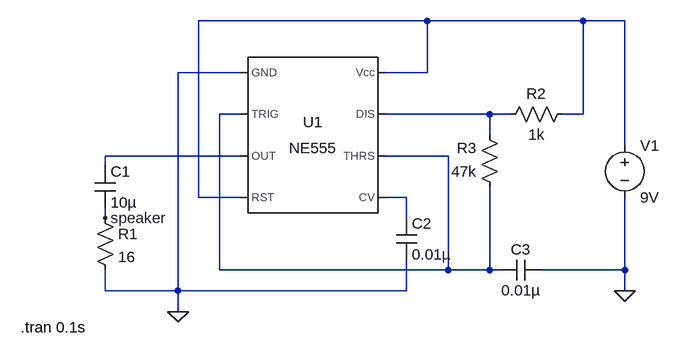
[diagram p0: schematic 555Oscillator.asc]
555Oscillator.asc, the LTspice schematic file:
Version 4
SHEET 1 880 680
WIRE 384 0 32 0
WIRE 624 0 384 0
WIRE 688 0 624 0
WIRE 96 80 0 80
WIRE 384 80 384 0
WIRE 384 80 320 80
WIRE 96 144 64 144
WIRE 480 144 320 144
WIRE 512 144 480 144
WIRE 624 144 624 0
WIRE 624 144 592 144
WIRE 480 176 480 144
WIRE 688 192 688 0
WIRE 96 208 -112 208
WIRE 416 208 320 208
WIRE -112 224 -112 208
WIRE 32 272 32 0
WIRE 96 272 32 272
WIRE 352 272 320 272
WIRE -112 304 -112 288
WIRE 352 304 352 272
WIRE 64 384 64 144
WIRE 416 384 416 208
WIRE 416 384 64 384
WIRE 480 384 480 256
WIRE 480 384 416 384
WIRE 496 384 480 384
WIRE 688 384 688 272
WIRE 688 384 560 384
WIRE -112 416 -112 384
WIRE 0 416 0 80
WIRE 0 416 -112 416
WIRE 352 416 352 368
WIRE 352 416 0 416
WIRE 688 416 688 384
WIRE 0 448 0 416
FLAG 0 448 0
FLAG 688 416 0
FLAG -112 304 speaker
SYMBOL Misc\\NE555 208 176 R0
SYMATTR InstName U1
SYMBOL res -128 288 R0
SYMATTR InstName R1
SYMATTR Value 16
SYMBOL cap -128 224 R0
SYMATTR InstName C1
SYMATTR Value 10µ
SYMBOL cap 336 304 R0
SYMATTR InstName C2
SYMATTR Value 0.01µ
SYMBOL cap 560 368 R90
WINDOW 0 0 32 VBottom 2
WINDOW 3 32 32 VTop 2
SYMATTR InstName C3
SYMATTR Value 0.01µ
SYMBOL voltage 688 176 R0
WINDOW 123 0 0 Left 0
WINDOW 39 0 0 Left 0
SYMATTR InstName V1
SYMATTR Value 9V
SYMBOL res 608 128 R90
WINDOW 0 0 56 VBottom 2
WINDOW 3 32 56 VTop 2
SYMATTR InstName R2
SYMATTR Value 1k
SYMBOL res 496 272 R180
WINDOW 0 36 76 Left 2
WINDOW 3 36 40 Left 2
SYMATTR InstName R3
SYMATTR Value 47k
TEXT -242 472 Left 2 !.tran 0.1s

The netlist it stands for:
* 555Oscillator.asc
XU1 0 N002 N004 N001 N005 N002 N003 N001 NE555  ; pins GND TRIG OUT RST CV THRS DIS Vcc
R1 speaker 0 16
C1 N004 speaker 10µ
C2 N005 0 0.01µ
C3 0 N002 0.01µ
V1 N001 0 9V
R2 N001 N003 1k
R3 N002 N003 47k
.tran 0.1s
.lib NE555.sub
.backanno
.end